# EAGLE schematic attinydevboard (EAGLE 9.0.1)
VERSION: 1.0b0
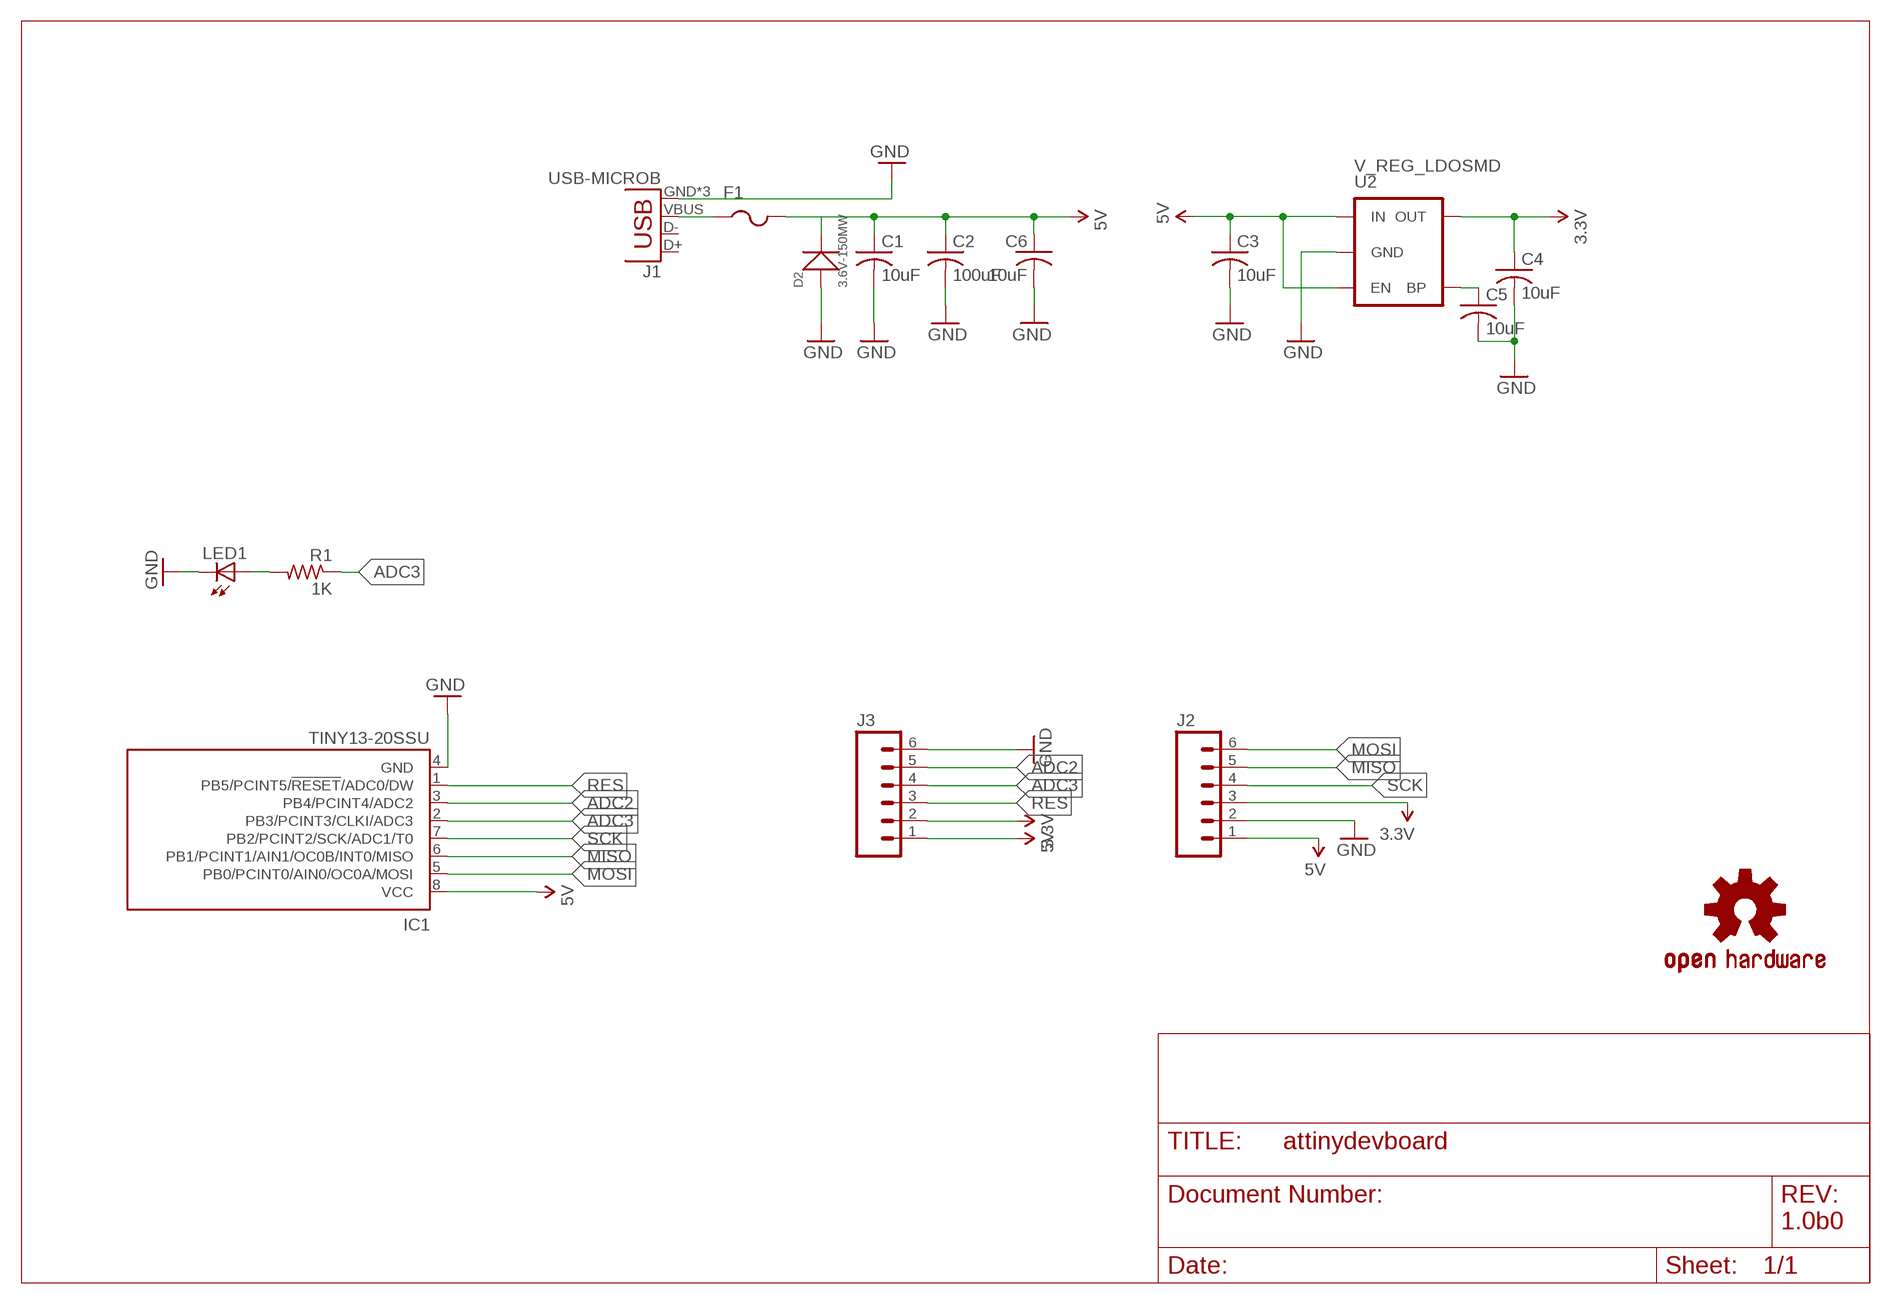
[diagram p0: schematic, sheet 1]

## Parts
C1  10uF  C-USC0603  [C0603]
C2  100uF  C-USC0603  [C0603]
C3  10uF  C-USC0603  [C0603]
C4  10uF  C-USC0603  [C0603]
C5  10uF  C-USC0603  [C0603]
C6  10uF  C-USC0603  [C0603]
D2  3.6V-150MW  SMD-DIODE-ZENER-3.6V-150MW(SOD-523)  [SOD-523]
F1  PTCFUSE-1206  [R1206]
IC1  TINY13-20SSU  [8S1]
J1  USB-MICROB  [USB-MICROB]
J2  M06SIP  [1X06]
J3  M06SIP  [1X06]
LED1  LED0603  [LED-0603]
R1  1K  R-US_R0603  [R0603]
U2  V_REG_LDOSMD  [SOT23-5]
U$2  OSHW-LOGOS  [OSHW-LOGO-S]

## Nets
3.3V: C4.1 J2.3 J3.2 U2.5(OUT)
5V: C1.1 C2.1 C3.1 C6.1 D2.- F1.2 IC1.8(VCC) J2.1 J3.1 U2.1(IN) U2.3(EN)
ADC2: IC1.3(PB4/PCINT4/ADC2) J3.5
ADC3: IC1.2(PB3/PCINT3/CLKI/ADC3) J3.4 R1.1
GND: C1.2 C2.2 C3.2 C4.2 C5.2 C6.2 D2.+ IC1.4(GND) J1.GND J1.MT1(GND) J1.MT2(GND) J2.2 J3.6 LED1.C U2.2(GND)
MISO: IC1.6(PB1/PCINT1/AIN1/OC0B/INT0/MISO) J2.5
MOSI: IC1.5(PB0/PCINT0/AIN0/OC0A/MOSI) J2.6
N$1: LED1.A R1.2
N$5: F1.1 J1.VBUS
N$12: C5.1 U2.4(BP)
RES: IC1.1(PB5/PCINT5/!RESET!/ADC0/DW) J3.3
SCK: IC1.7(PB2/PCINT2/SCK/ADC1/T0) J2.4
Unconnected: J1.D+ J1.D-

## Library data of the parts
C1-C6 = resistor:C-US: CAPACITOR, American symbol
D2 = Seeed-OPL-Diode:SMD-DIODE-ZENER-3.6V-150MW(SOD-523): 304030019; MPN: BZX584C3V6
F1 = adafruit:PTCFUSE: PTC fuses, resettable thermistors
IC1 = atmel:TINY13: 8-bit AVR Microcontroller with 1K Bytes In-System Programmable Flash Source: http://www.atmel.com/dyn/resources/prod_documents/2535S.pdf; MPN: ATTINY13-20SSU; OC_FARNELL: 1455133; OC_NEWARK: 58M3771
J1 = SparkFun-Connectors:USB: USB Connectors USB-B-PTH is fully proven SKU : PRT-00139/CONN-08278 USB-miniB is fully proven SKU : PRT-00587 USB-A-PCB is untested. USB-A-H is throughly reviewed, but untested. Spark Fun Electronics SKU : PRT-00437 USB-B-SMT is throughly reviewed, but untested. Needs silkscreen touching up. USB-A-S has not been used/tested USB-MB-H has not been used/tested USB-MICROB has been used. CONN-09505; PROD_ID: CONN-09505
J2 J3 = SparkFun:M06: Header 6 Standard 6-pin 0.1" header. Use with straight break away headers (SKU : PRT-00116), right angle break away headers (PRT-00553), swiss pins (PRT-00743), machine pins (PRT-00117), and female headers (PRT-00115). Molex polarized connector foot print use with SKU : PRT-08094 with associated crimp pins and housings. NOTES ON THE VARIANTS LOCK and LOCK_LONGPADS... This footprint was designed to help hold the alignment of a through-hole component (i.e. 6-pin header) while soldering it into place. You may notice that each hole has been shifted either up or down by 0.005 of an inch from it's more standard position (which is a perfectly straight line). This slight alteration caused the pins (the squares in the middle) to touch the edges of the holes. Because they are alternating, it causes a "brace" to hold the component in place. 0.005 has proven to be the perfect amount of "off-center" position when using our standard breakaway headers. Although looks a little odd when you look at the bare footprint, once you have a header in there, the alteration is very hard to notice. Also, if you push a header all the way into place, it is covered up entirely on the bottom side. This idea of altering the position of holes to aid alignment will be further integrated into the Sparkfun Library for other footprints. It can help hold any component with 3 or more connection pins.
LED1 = SparkFun:LED: LEDs Standard schematic elements and footprints for 5mm, 3mm, 1206, and 0603 sized LEDs. 5mm - Spark Fun Electronics SKU : COM-00529 (and others)
R1 = adafruit:R-US_: RESISTOR, American symbol
U2 = SparkFun:V_REG_LDO: Voltage Regulator LDO Standard 150mA LDO voltage regulator in SOT-23 layout. Micrel part MIC5205. BP (by-pass) pin is used to lower output noise with 470pF cap.
U$2 = SparkFun:OSHW-LOGO: Open Source Hardware Logo This logo indicates the piece of hardware it is found on incorporates a OSHW license and/or adheres to the definition of open source hardware found here: http://freedomdefined.org/OSHW